# Altium project neon_panel.PrjPcb
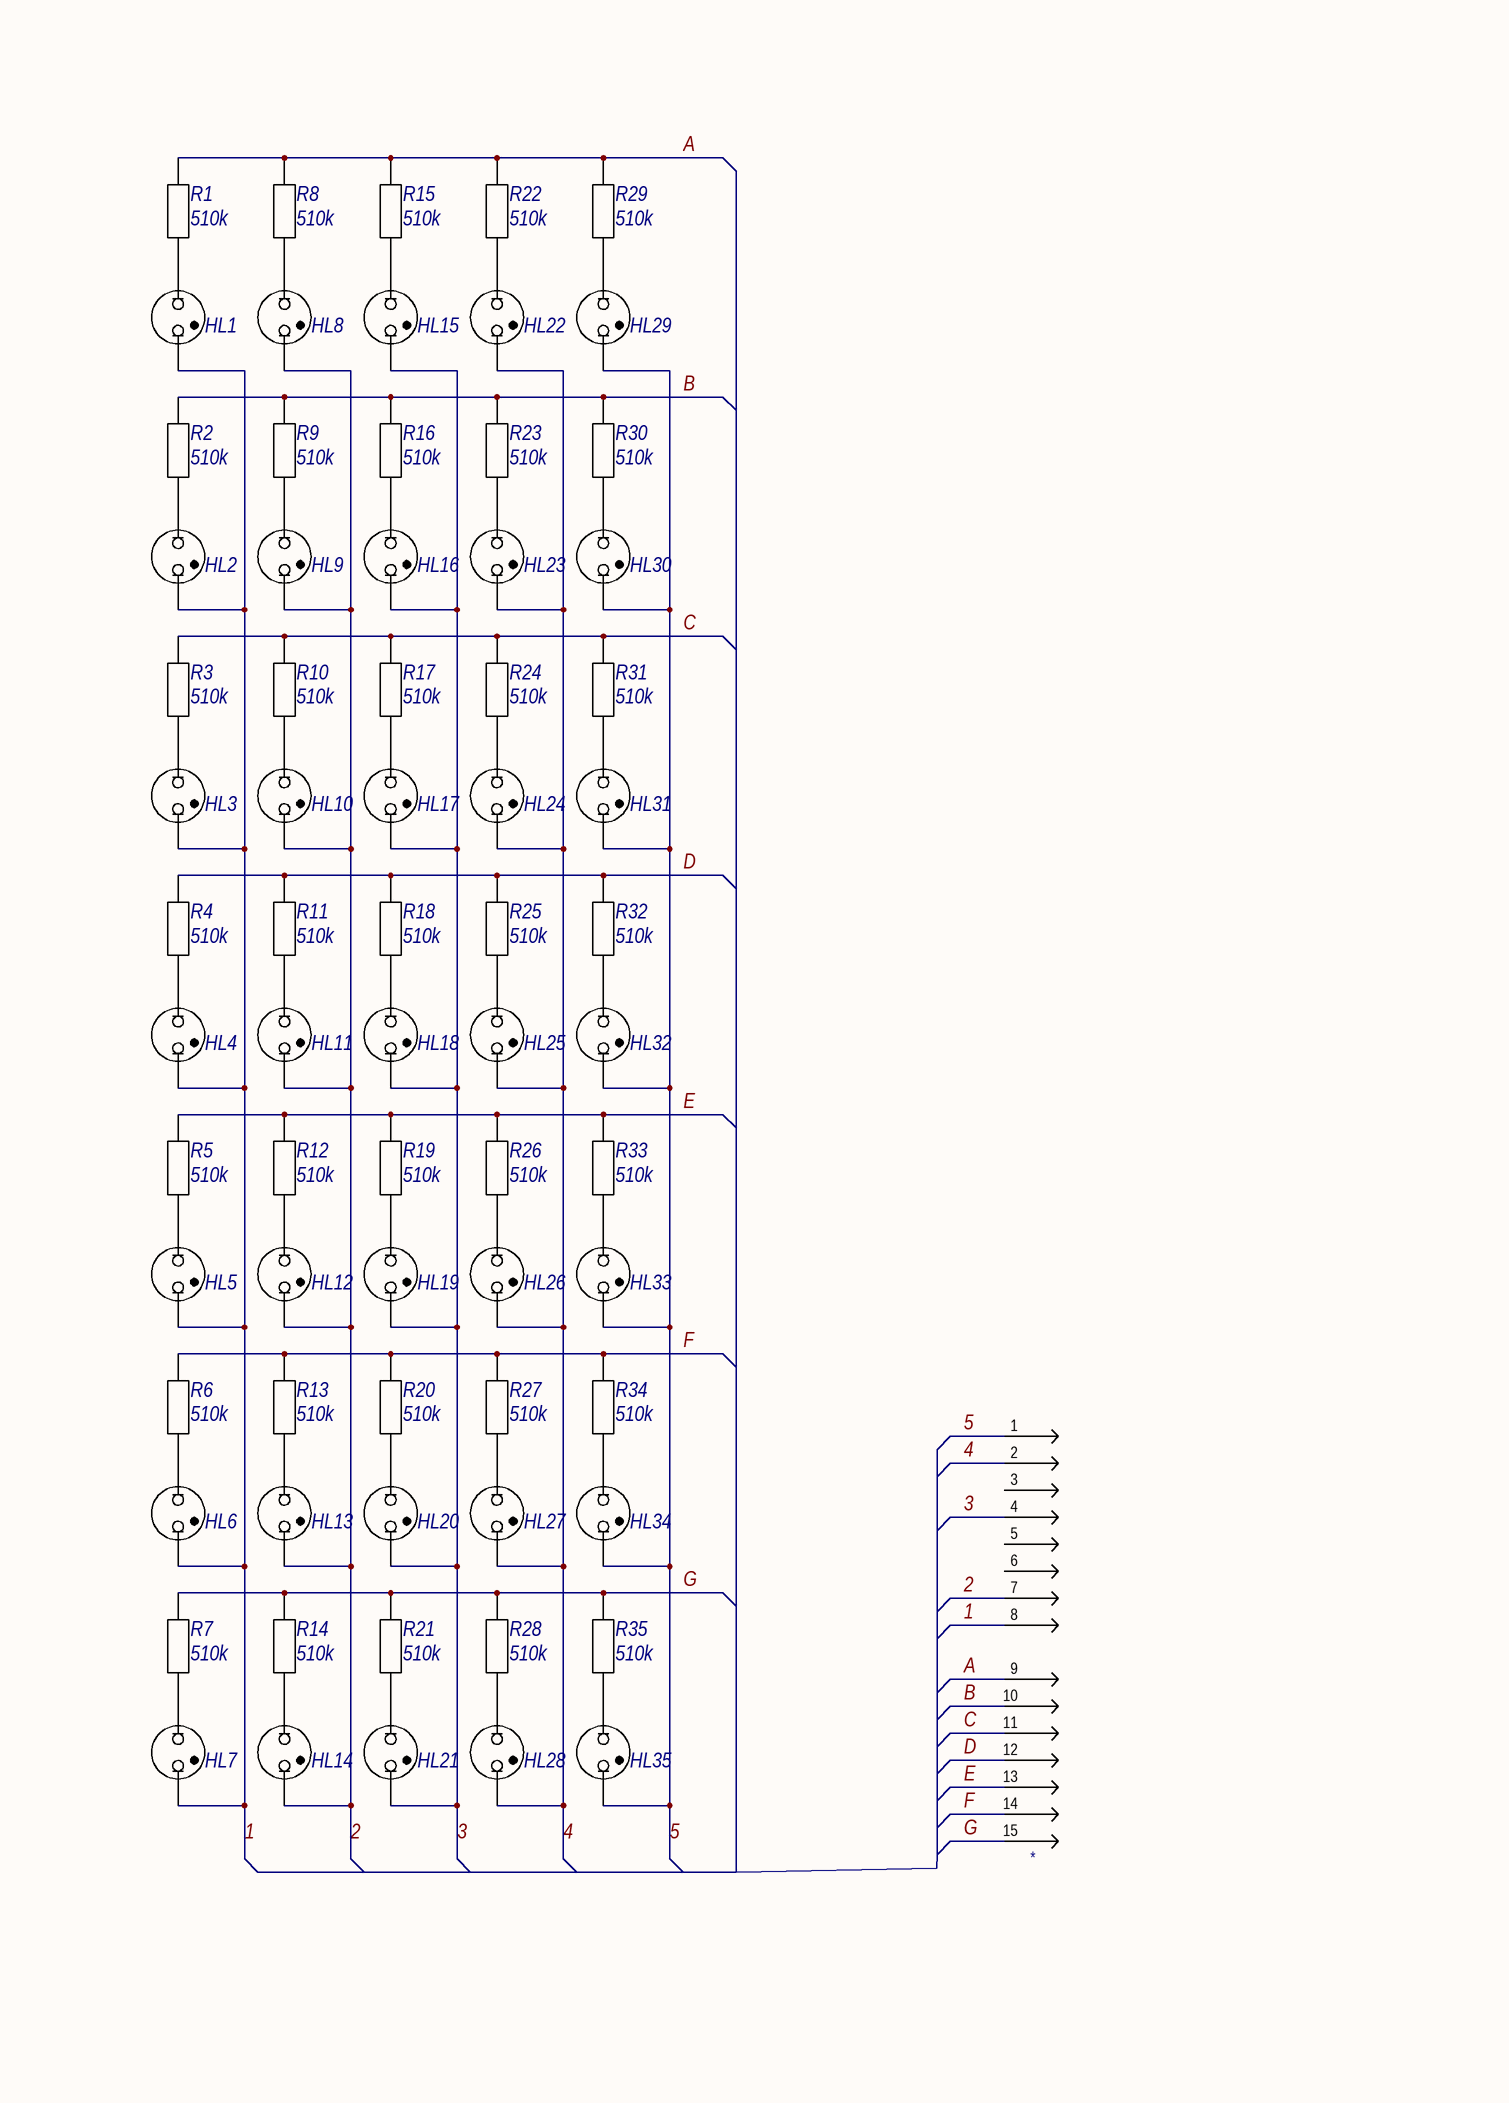
[diagram p0: Sheet1.SchDoc]
1 sheet, 71 parts. Net scope: global (net labels, ports and power ports of the same name join across sheets).
Board file: PCB1.PcbDoc

## Sheet Sheet1.SchDoc
size A3 portrait; SheetNumber: 1; SheetTotal: 1

### Parts
*  Component_1  [DB-15 on PCB]  (value not drawn)
HL1  ne-2  [ne2-4x10]  (value not drawn)
HL2  ne-2  [ne2-4x10]  (value not drawn)
HL3  ne-2  [ne2-4x10]  (value not drawn)
HL4  ne-2  [ne2-4x10]  (value not drawn)
HL5  ne-2  [ne2-4x10]  (value not drawn)
HL6  ne-2  [ne2-4x10]  (value not drawn)
HL7  ne-2  [ne2-4x10]  (value not drawn)
HL8  ne-2  [ne2-4x10]  (value not drawn)
HL9  ne-2  [ne2-4x10]  (value not drawn)
HL10  ne-2  [ne2-4x10]  (value not drawn)
HL11  ne-2  [ne2-4x10]  (value not drawn)
HL12  ne-2  [ne2-4x10]  (value not drawn)
HL13  ne-2  [ne2-4x10]  (value not drawn)
HL14  ne-2  [ne2-4x10]  (value not drawn)
HL15  ne-2  [ne2-4x10]  (value not drawn)
HL16  ne-2  [ne2-4x10]  (value not drawn)
HL17  ne-2  [ne2-4x10]  (value not drawn)
HL18  ne-2  [ne2-4x10]  (value not drawn)
HL19  ne-2  [ne2-4x10]  (value not drawn)
HL20  ne-2  [ne2-4x10]  (value not drawn)
HL21  ne-2  [ne2-4x10]  (value not drawn)
HL22  ne-2  [ne2-4x10]  (value not drawn)
HL23  ne-2  [ne2-4x10]  (value not drawn)
HL24  ne-2  [ne2-4x10]  (value not drawn)
HL25  ne-2  [ne2-4x10]  (value not drawn)
HL26  ne-2  [ne2-4x10]  (value not drawn)
HL27  ne-2  [ne2-4x10]  (value not drawn)
HL28  ne-2  [ne2-4x10]  (value not drawn)
HL29  ne-2  [ne2-4x10]  (value not drawn)
HL30  ne-2  [ne2-4x10]  (value not drawn)
HL31  ne-2  [ne2-4x10]  (value not drawn)
HL32  ne-2  [ne2-4x10]  (value not drawn)
HL33  ne-2  [ne2-4x10]  (value not drawn)
HL34  ne-2  [ne2-4x10]  (value not drawn)
HL35  ne-2  [ne2-4x10]  (value not drawn)
R1  Resistance: 510k  [R1206]  (hidden comment: R-1206 0,25 Вт 510kОм Yageo)
R2  Resistance: 510k  [R1206]  (hidden comment: R-1206 0,25 Вт 510kОм Yageo)
R3  Resistance: 510k  [R1206]  (hidden comment: R-1206 0,25 Вт 510kОм Yageo)
R4  Resistance: 510k  [R1206]  (hidden comment: R-1206 0,25 Вт 510kОм Yageo)
R5  Resistance: 510k  [R1206]  (hidden comment: R-1206 0,25 Вт 510kОм Yageo)
R6  Resistance: 510k  [R1206]  (hidden comment: R-1206 0,25 Вт 510kОм Yageo)
R7  Resistance: 510k  [R1206]  (hidden comment: R-1206 0,25 Вт 510kОм Yageo)
R8  Resistance: 510k  [R1206]  (hidden comment: R-1206 0,25 Вт 510kОм Yageo)
R9  Resistance: 510k  [R1206]  (hidden comment: R-1206 0,25 Вт 510kОм Yageo)
R10  Resistance: 510k  [R1206]  (hidden comment: R-1206 0,25 Вт 510kОм Yageo)
R11  Resistance: 510k  [R1206]  (hidden comment: R-1206 0,25 Вт 510kОм Yageo)
R12  Resistance: 510k  [R1206]  (hidden comment: R-1206 0,25 Вт 510kОм Yageo)
R13  Resistance: 510k  [R1206]  (hidden comment: R-1206 0,25 Вт 510kОм Yageo)
R14  Resistance: 510k  [R1206]  (hidden comment: R-1206 0,25 Вт 510kОм Yageo)
R15  Resistance: 510k  [R1206]  (hidden comment: R-1206 0,25 Вт 510kОм Yageo)
R16  Resistance: 510k  [R1206]  (hidden comment: R-1206 0,25 Вт 510kОм Yageo)
R17  Resistance: 510k  [R1206]  (hidden comment: R-1206 0,25 Вт 510kОм Yageo)
R18  Resistance: 510k  [R1206]  (hidden comment: R-1206 0,25 Вт 510kОм Yageo)
R19  Resistance: 510k  [R1206]  (hidden comment: R-1206 0,25 Вт 510kОм Yageo)
R20  Resistance: 510k  [R1206]  (hidden comment: R-1206 0,25 Вт 510kОм Yageo)
R21  Resistance: 510k  [R1206]  (hidden comment: R-1206 0,25 Вт 510kОм Yageo)
R22  Resistance: 510k  [R1206]  (hidden comment: R-1206 0,25 Вт 510kОм Yageo)
R23  Resistance: 510k  [R1206]  (hidden comment: R-1206 0,25 Вт 510kОм Yageo)
R24  Resistance: 510k  [R1206]  (hidden comment: R-1206 0,25 Вт 510kОм Yageo)
R25  Resistance: 510k  [R1206]  (hidden comment: R-1206 0,25 Вт 510kОм Yageo)
R26  Resistance: 510k  [R1206]  (hidden comment: R-1206 0,25 Вт 510kОм Yageo)
R27  Resistance: 510k  [R1206]  (hidden comment: R-1206 0,25 Вт 510kОм Yageo)
R28  Resistance: 510k  [R1206]  (hidden comment: R-1206 0,25 Вт 510kОм Yageo)
R29  Resistance: 510k  [R1206]  (hidden comment: R-1206 0,25 Вт 510kОм Yageo)
R30  Resistance: 510k  [R1206]  (hidden comment: R-1206 0,25 Вт 510kОм Yageo)
R31  Resistance: 510k  [R1206]  (hidden comment: R-1206 0,25 Вт 510kОм Yageo)
R32  Resistance: 510k  [R1206]  (hidden comment: R-1206 0,25 Вт 510kОм Yageo)
R33  Resistance: 510k  [R1206]  (hidden comment: R-1206 0,25 Вт 510kОм Yageo)
R34  Resistance: 510k  [R1206]  (hidden comment: R-1206 0,25 Вт 510kОм Yageo)
R35  Resistance: 510k  [R1206]  (hidden comment: R-1206 0,25 Вт 510kОм Yageo)

### Nets
1: *.8 HL1.2(A) HL2.2(A) HL3.2(A) HL4.2(A) HL5.2(A) HL6.2(A) HL7.2(A)
2: *.7 HL8.2(A) HL9.2(A) HL10.2(A) HL11.2(A) HL12.2(A) HL13.2(A) HL14.2(A)
3: *.4 HL15.2(A) HL16.2(A) HL17.2(A) HL18.2(A) HL19.2(A) HL20.2(A) HL21.2(A)
4: *.2 HL22.2(A) HL23.2(A) HL24.2(A) HL25.2(A) HL26.2(A) HL27.2(A) HL28.2(A)
5: *.1(C4) HL29.2(A) HL30.2(A) HL31.2(A) HL32.2(A) HL33.2(A) HL34.2(A) HL35.2(A)
A: *.9 R1.2 R8.2 R15.2 R22.2 R29.2
B: *.10 R2.2 R9.2 R16.2 R23.2 R30.2
C: *.11 R3.2 R10.2 R17.2 R24.2 R31.2
D: *.12 R4.2 R11.2 R18.2 R25.2 R32.2
E: *.13 R5.2 R12.2 R19.2 R26.2 R33.2
F: *.14 R6.2 R13.2 R20.2 R27.2 R34.2
G: *.15 R7.2 R14.2 R21.2 R28.2 R35.2
NetHL1_1: HL1.1(K) R1.1
NetHL2_1: HL2.1(K) R2.1
NetHL3_1: HL3.1(K) R3.1
NetHL4_1: HL4.1(K) R4.1
NetHL5_1: HL5.1(K) R5.1
NetHL6_1: HL6.1(K) R6.1
NetHL7_1: HL7.1(K) R7.1
NetHL8_1: HL8.1(K) R8.1
NetHL9_1: HL9.1(K) R9.1
NetHL10_1: HL10.1(K) R10.1
NetHL11_1: HL11.1(K) R11.1
NetHL12_1: HL12.1(K) R12.1
NetHL13_1: HL13.1(K) R13.1
NetHL14_1: HL14.1(K) R14.1
NetHL15_1: HL15.1(K) R15.1
NetHL16_1: HL16.1(K) R16.1
NetHL17_1: HL17.1(K) R17.1
NetHL18_1: HL18.1(K) R18.1
NetHL19_1: HL19.1(K) R19.1
NetHL20_1: HL20.1(K) R20.1
NetHL21_1: HL21.1(K) R21.1
NetHL22_1: HL22.1(K) R22.1
NetHL23_1: HL23.1(K) R23.1
NetHL24_1: HL24.1(K) R24.1
NetHL25_1: HL25.1(K) R25.1
NetHL26_1: HL26.1(K) R26.1
NetHL27_1: HL27.1(K) R27.1
NetHL28_1: HL28.1(K) R28.1
NetHL29_1: HL29.1(K) R29.1
NetHL30_1: HL30.1(K) R30.1
NetHL31_1: HL31.1(K) R31.1
NetHL32_1: HL32.1(K) R32.1
NetHL33_1: HL33.1(K) R33.1
NetHL34_1: HL34.1(K) R34.1
NetHL35_1: HL35.1(K) R35.1

Not connected (* = marked no-connect by the designer): * 3 5 6

### Library data of the parts
HL1-HL35 = ne-2: Neon Bulb Indicator Lamps 4mm Red; Name: Neon lamp; Current: 0,3 mA; Package: 4x10
R1-R35 = R1206: Name: Resistor; Power: 0,25 Вт; Tolerance: 5%; Package: R-1206; Manufacturer: Yageo